# EAGLE design pulzní regulátor (EAGLE 9.5.1)
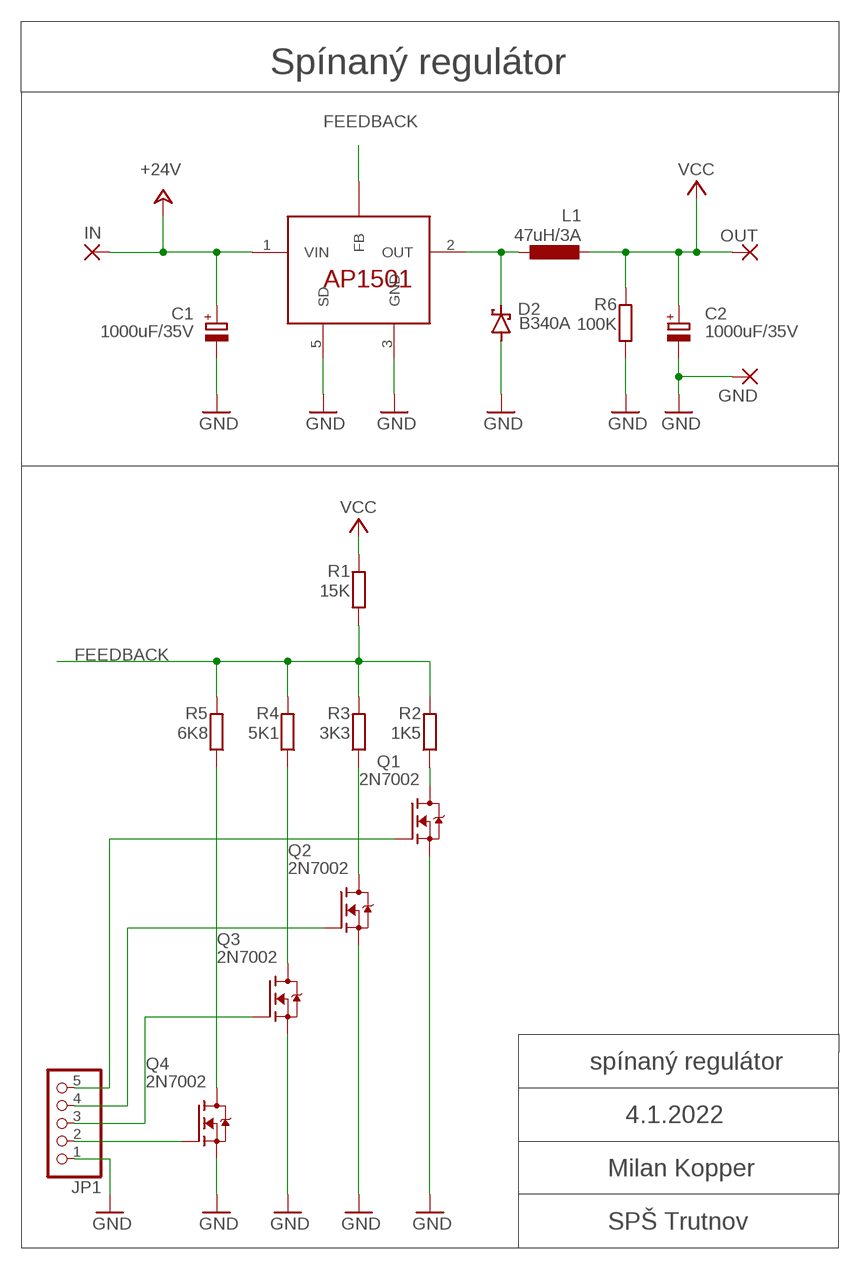
[diagram p0: schematic, sheet 1]

## Parts
C1  1000uF/35V  CPOL-EUE5-10.5  [E5-10,5]
C2  1000uF/35V  CPOL-EUE5-10.5  [E5-10,5]
D2  B340A  MBRS130LT3  [SMB]
GND  3,17/1,3  [3,17/1,3]
IN  3,17/1,3  [3,17/1,3]
JP1  PINHD-1X5  [1X05]
L1  47uH/3A  DTMSSDTMSS-16/0,033/6,0  [DTMSS-16/0,033/6,0]
OUT  3,17/1,3  [3,17/1,3]
Q1  2N7002  NX3008  [SOT95P240X110-3N]
Q2  2N7002  NX3008  [SOT95P240X110-3N]
Q3  2N7002  NX3008  [SOT95P240X110-3N]
Q4  2N7002  NX3008  [SOT95P240X110-3N]
R1  15K  R-EU_R0805  [R0805]
R2  1K5  R-EU_R0805  [R0805]
R3  3K3  R-EU_R0805  [R0805]
R4  5K1  R-EU_R0805  [R0805]
R5  6K8  R-EU_R0805  [R0805]
R6  100K  R-EU_R0805  [R0805]
U$2  AP1501TO220  [TO220-5]

## Nets
+24V: C1.+ IN.1(P) U$2.1(VIN)
FEEDBACK: R1.1 R2.2 R3.2 R4.2 R5.2 U$2.4(FB)
GND: C1.- C2.- D2.A GND.1(P) JP1.1 Q1.2(S) Q2.2(S) Q3.2(S) Q4.2(S) R6.1 U$2.3(GND) U$2.5(SD)
N$1: Q4.3(D) R5.1
N$3: D2.C L1.P$1 U$2.2(OUT)
N$5: JP1.2 Q4.1(G)
N$7: Q1.3(D) R2.1
N$8: JP1.3 Q3.1(G)
N$9: JP1.4 Q2.1(G)
N$10: JP1.5 Q1.1(G)
N$11: Q2.3(D) R3.1
N$12: Q3.3(D) R4.1
VCC: C2.+ L1.P$2 OUT.1(P) R1.2 R6.2

## Notes on the sheet
- Spínaný regulátor
- spínaný regulátor
- 4.1.2022
- Milan Kopper
- SPŠ Trutnov

## Library data of the parts
C1 C2 = rcl:CPOL-EU: POLARIZED CAPACITOR, European symbol; SPICEPREFIX: C
D2 = diode:MBRS130LT3: Schottky Power Rectifier Source: http://www.onsemi.com/pub/Collateral/MBRS130LT3-D.PDF
GND IN OUT = wirepad:3,17/1,3: THROUGH-HOLE PAD
JP1 = pinhead:PINHD-1X5: PIN HEADER
L1 = induktory a trafa:DTMSS
Q1-Q4 = NEXPERIA :NX3008
R1-R6 = rcl:R-EU_: RESISTOR, European symbol; SPICEPREFIX: R
U$2 = regulators:AP1501

## Board
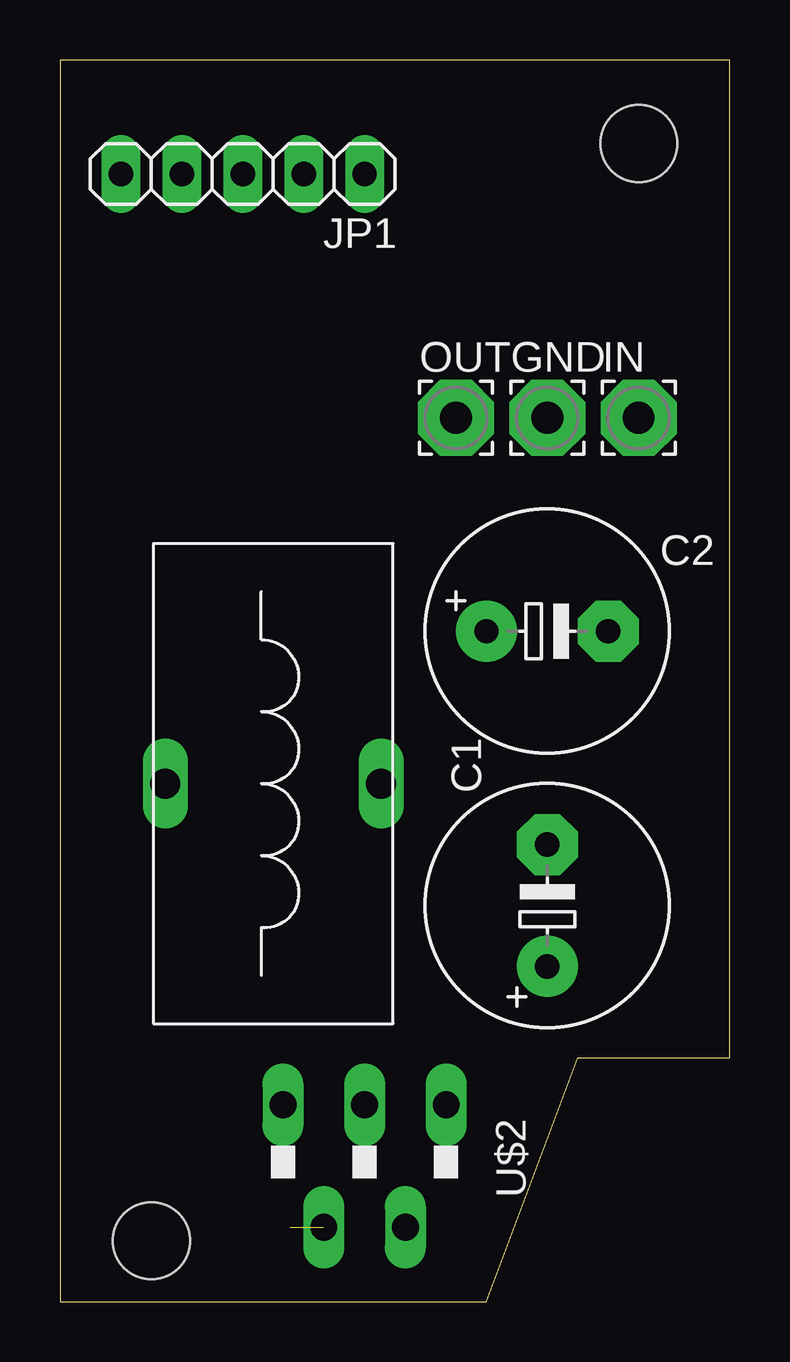
[diagram p1: board, top side]
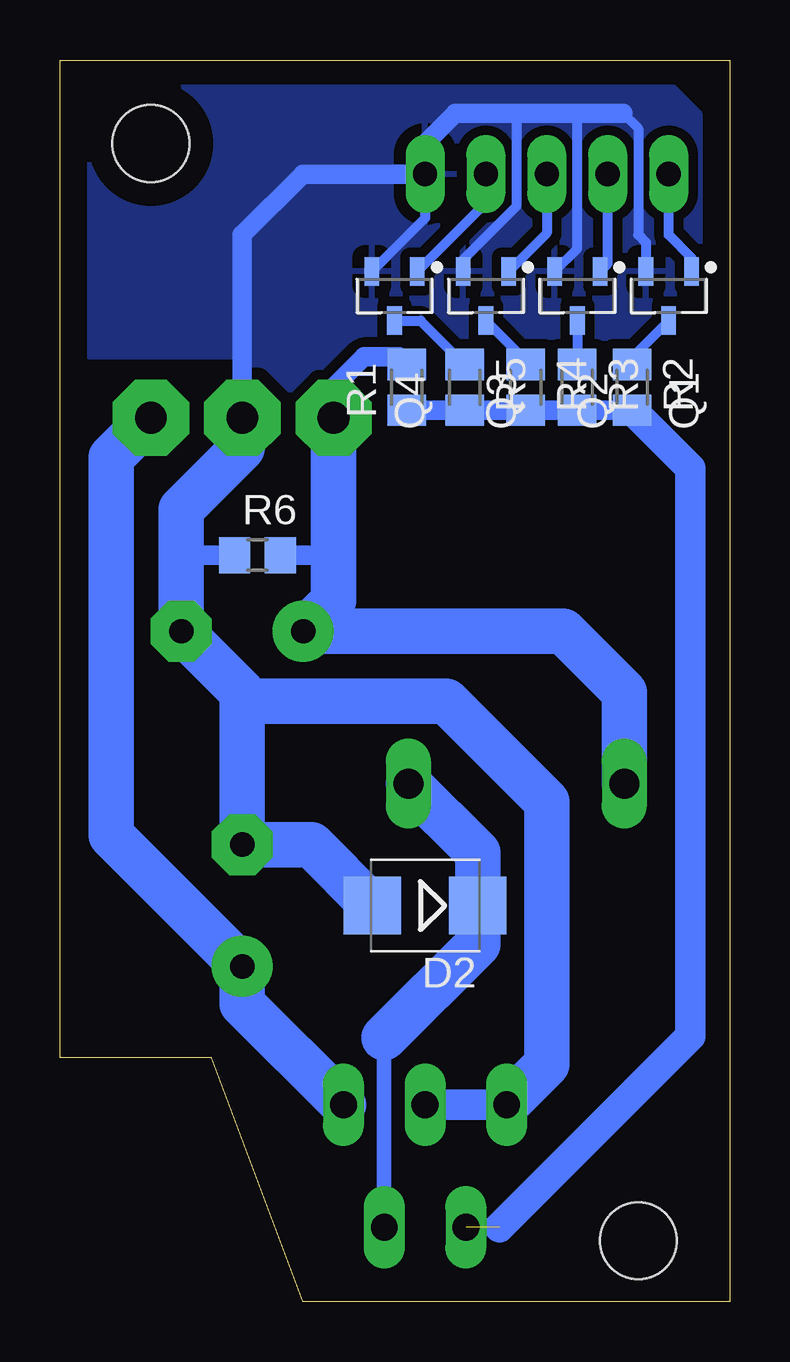
[diagram p2: board, bottom side, seen from below]

Size 27.92 x 51.74 mm. Coordinates in mm from the lower left corner, seen from the top.
Outline: 0,0 17.78,0 21.59,10.16 27.92,10.16 27.92,51.74 0,51.74 0,0
Copper layers (1*16): Top 0.035mm / dielectric 1.5mm / Bottom 0.035mm
Design rules "SPS_Trutnov_F14": minimum track width 0.3mm, minimum drill 0.6mm, track to track 8mil, track to pad 0.2mm, pad to pad 0.2mm, via to via 0.2mm, smd to smd 0mil, copper to edge 1mm, drill to drill 0.6mm, minimum pad ring 0.3mm, minimum via ring 0.3mm, stop-mask expansion 0.1mm, vias tented up to drill 3mm, thermal gap 20mil
Holes 3.2 mm at 3.81,2.54 24.13,48.26

### Footprints (pad centres in the part's own frame; a part is rotated, then mirrored left to right if it is on the bottom)
E5-10,5 = drill 1.016 pad 2.54: + -2.54,0 | drill 1.016 pad 2.54 octagon: - 2.54,0
SMB = smd 2.4 x 2.4: A 2.2,0; C -2.2,0
3,17/1,3 = drill 1.321 pad 3.175 octagon: 1 0,0
1X05 = drill 1.016 long: 1 -5.08,0; 2 -2.54,0; 3 0,0; 4 2.54,0; 5 5.08,0
DTMSS-16/0,033/6,0 = drill 1.25 long: P$1 0,4.5; P$2 0,-4.5
SOT95P240X110-3N = smd 1.182 x 0.612: 1 -1.025,0.95; 2 -1.025,-0.95; 3 1.025,0
M0805 = smd 1.3 x 1.6: 1 -0.95,0; 2 0.95,0
R0805 = smd 1.3 x 1.5: 1 -0.95,0; 2 0.95,0
TO220-5 = drill 1.118 pad 1.626 long: 1 -3.404,-8.211; 2 -1.702,-3.105; 3 0,-8.211; 4 1.702,-3.105; 5 3.404,-8.211

### Placement (x,y rotation side)
C1  20.32,16.51 90 top
C2  20.32,27.94 0 top
D2  12.7,16.51 180 bottom
GND  20.32,36.83 0 top
IN  24.13,36.83 0 top
JP1  7.62,46.99 180 top
L1  8.89,21.59 270 top
OUT  16.51,36.83 0 top
Q1  2.54,41.91 270 bottom
Q2  6.35,41.91 270 bottom
Q3  10.16,41.91 270 bottom
Q4  13.97,41.91 270 bottom
R1  15K  [M0805]  13.46,38.1 90 bottom
R2  1K5  [M0805]  4.06,38.1 270 bottom
R3  3K3  [M0805]  6.35,38.1 270 bottom
R4  5K1  [M0805]  8.51,38.1 270 bottom
R5  6K8  [M0805]  11.05,38.1 270 bottom
R6  19.68,31.11 0 bottom
U$2  12.7,0 180 top

### Tracks (layer width: path | path; a pad name or v marks a point on that pad's centre or on a via)
+24V
  Bottom 1.905: U$2.1 20.32,12.43 C1.+ 25.78,19.43 25.78,35.18 IN.1
FEEDBACK  (1 unrouted)
  Bottom 0.813: R1.1 R5.2 R4.2 R3.2 R2.2
  Bottom 1.27: R2.2 1.64,34.72 1.64,11.07 9.6,3.1
GND
  Bottom 0.406: 8.89,49.53 8.89,45.64 11.11,43.42 Q3.2 | Q2.2 6.35,43.88 6.35,49.53 | JP1.1 12.7,45.15 Q4.2 | Q1.2 3.49,44.13 3.81,44.45 3.81,48.89 4.45,49.53
  Bottom 0.813: GND.1 20.32,44.45 17.78,46.99 JP1.1 12.7,48.26 11.43,49.53 8.89,49.53 6.35,49.53 4.45,49.53 | R6.1 22.23,31.11 22.86,30.48
  Bottom 1.27: U$2.3 U$2.5
  Bottom 1.905: U$2.5 7.62,9.89 7.62,20.83 11.81,25.02 20.32,25.02 | 20.32,25.02 C1.- 17.44,19.05 D2.A | 20.32,25.02 20.32,25.4 C2.- 22.86,30.48 22.86,33.02 20.32,35.56 GND.1
  pour Bottom (isolate 0.406): 1.27,33.02 13.97,33.02 20.32,39.37 26.67,39.37 26.67,49.53 25.4,50.8 2.54,50.8 1.27,49.53
N$1
  Bottom 0.406: Q4.3 12.88,40.88 R5.1
N$3
  Bottom 0.61: U$2.2 14.4,11
  Bottom 1.905: L1.P$1 10.5,18.7 D2.C 10.5,14.9 14.4,11
N$5
  Bottom 0.406: Q4.1 10.16,45.79 JP1.2
N$7
  Bottom 0.406: Q1.3 4.06,39.36 R2.1
N$8
  Bottom 0.406: JP1.3 7.62,44.52 Q3.1
N$9
  Bottom 0.406: Q2.1 5.08,43.25 JP1.4
N$10
  Bottom 0.406: Q1.1 1.59,43.5 2.54,44.45 JP1.5
N$11
  Bottom 0.406: Q2.3 R3.1
N$12
  Bottom 0.406: R4.1 8.51,39.23 Q3.3
VCC
  Bottom 0.813: R1.2 13.78,39.37 15.24,39.37 16.51,38.1 OUT.1 | R6.2 17.14,31.11 16.51,30.48
  Bottom 1.905: L1.P$2 4.39,25.4 6.93,27.94 C2.+ 16.51,29.21 16.51,30.48 OUT.1